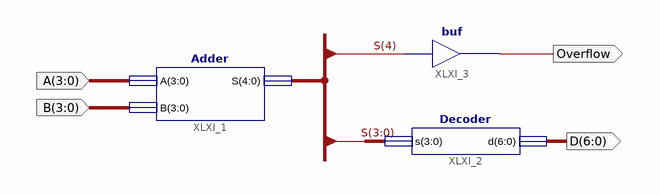
[diagram p0: schematic sheet 1]
// Xilinx ISE schematic Display.sch (spartan3) as structural Verilog: 3 symbols, 4 ports
module Display (
  input  [3:0] A,
  input  [3:0] B,
  output Overflow,
  output [6:0] D
);

  wire [4:0] S;

  Adder XLXI_1 (.A(A), .B(B), .S(S));
  Decoder XLXI_2 (.s(S[3:0]), .d(D));
  buf XLXI_3 (Overflow, S[4]);
endmodule
